# Altium schematic sheet esp32_breakout.SchDoc
size A1
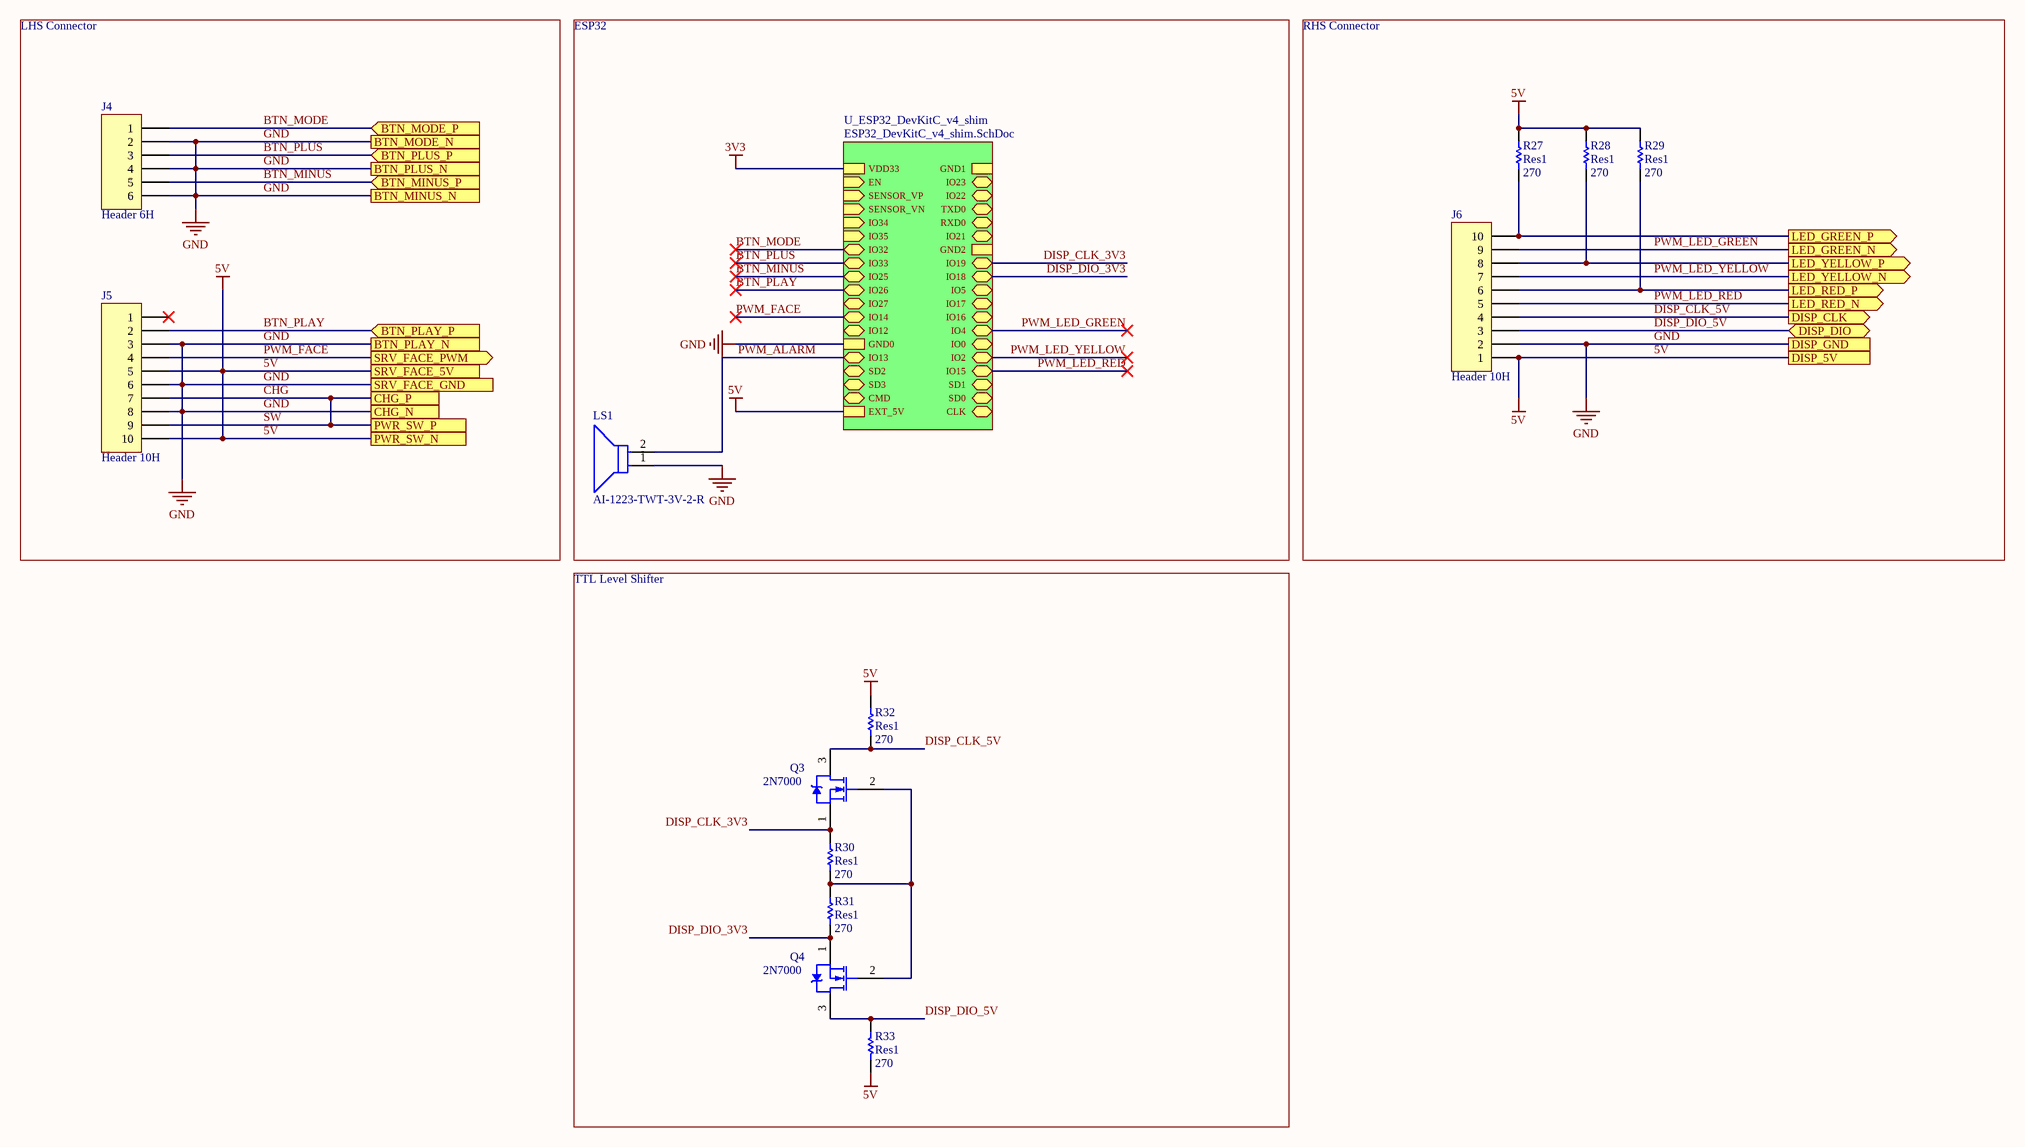
[diagram p0: esp32_breakout.SchDoc]

## Parts
J4  Header 6H  [HDR1X6H]
J5  Header 10H  [HDR1X10H]
J6  Header 10H  [HDR1X10H]
LS1  AI-1223-TWT-3V-2-R  [FP-AI-1223-TWT-3V-2-R-MFG]
Q3  2N7000  [ONSC-TO-92-3-29-11]
Q4  2N7000  [ONSC-TO-92-3-29-11]
R27  Res1  value 270  [AXIAL-0.3]
R28  Res1  value 270  [AXIAL-0.3]
R29  Res1  value 270  [AXIAL-0.3]
R30  Res1  value 270  [AXIAL-0.3]
R31  Res1  value 270  [AXIAL-0.3]
R32  Res1  value 270  [AXIAL-0.3]
R33  Res1  value 270  [AXIAL-0.3]

## Blocks framed on the sheet
LHS Connector: J4 J5
ESP32: LS1
RHS Connector: J6 R27-R29
TTL Level Shifter: Q3 Q4 R30-R33

## Sub-sheets
U_ESP32_DevKitC_v4_shim = ESP32_DevKitC_v4_shim.SchDoc: IO23 (bidir), IO22 (bidir), TXD0 (bidir), RXD0 (bidir), IO21 (bidir), IO19 (bidir), IO18 (bidir), IO5 (bidir), IO17 (bidir), IO16 (bidir), IO4 (bidir), IO0 (bidir), IO2 (bidir), IO15 (bidir), SD1 (bidir), SD0 (bidir), CLK (bidir), GND1, GND2, VDD33, EN (in), SENSOR_VP (in), SENSOR_VN (in), IO34 (in), IO35 (in), IO32 (bidir), IO33 (bidir), IO25 (bidir), IO26 (bidir), IO27 (bidir), IO14 (bidir), IO12 (bidir), GND0, IO13 (bidir), SD2 (bidir), SD3 (bidir), CMD (bidir), EXT_5V

## Ports
BTN_MINUS_N, BTN_MINUS_P (in), BTN_MODE_N, BTN_MODE_P (in), BTN_PLAY_N, BTN_PLAY_P (in), BTN_PLUS_N, BTN_PLUS_P (in), CHG_N, CHG_P, DISP_5V, DISP_CLK (out), DISP_DIO (bidir), DISP_GND, LED_GREEN_N (out), LED_GREEN_P (out), LED_RED_N (out), LED_RED_P (out), LED_YELLOW_N (out), LED_YELLOW_P (out), PWR_SW_N, PWR_SW_P, SRV_FACE_5V, SRV_FACE_GND, SRV_FACE_PWM (out)

## Nets
3V3: sheet U_ESP32_DevKitC_v4_shim/VDD33
5V: J5.5 J5.10 J6.1 R27.2 R28.2 R29.2 R32.2 R33.2 ; port SRV_FACE_5V, port PWR_SW_N, port DISP_5V, sheet U_ESP32_DevKitC_v4_shim/EXT_5V
GND: J4.2 J4.4 J4.6 J5.3 J5.6 J5.8 J6.2 LS1.1(C) ; port BTN_MODE_N, port BTN_PLUS_N, port BTN_MINUS_N, port BTN_PLAY_N, port SRV_FACE_GND, port CHG_N, port DISP_GND, sheet U_ESP32_DevKitC_v4_shim/GND0
BTN_MINUS: J4.5 ; port BTN_MINUS_P, sheet U_ESP32_DevKitC_v4_shim/IO25
BTN_MODE: J4.1 ; port BTN_MODE_P, sheet U_ESP32_DevKitC_v4_shim/IO32
BTN_PLAY: J5.2 ; port BTN_PLAY_P, sheet U_ESP32_DevKitC_v4_shim/IO26
BTN_PLUS: J4.3 ; port BTN_PLUS_P, sheet U_ESP32_DevKitC_v4_shim/IO33
CHG: J5.7 J5.9 ; port CHG_P, port PWR_SW_P  [also labelled SW]
DISP_CLK_3V3: Q3.1(S) R30.2 ; sheet U_ESP32_DevKitC_v4_shim/IO19
DISP_CLK_5V: J6.4 Q3.3(D) R32.1 ; port DISP_CLK
DISP_DIO_3V3: Q4.1(S) R31.1 ; sheet U_ESP32_DevKitC_v4_shim/IO18
DISP_DIO_5V: J6.3 Q4.3(D) R33.1 ; port DISP_DIO
LED_GREEN_P: J6.10 R27.1 ; port LED_GREEN_P
LED_RED_P: J6.6 R29.1 ; port LED_RED_P
LED_YELLOW_P: J6.8 R28.1 ; port LED_YELLOW_P
PWM_ALARM: LS1.2(A) ; sheet U_ESP32_DevKitC_v4_shim/IO13
PWM_FACE: J5.4 ; port SRV_FACE_PWM, sheet U_ESP32_DevKitC_v4_shim/IO14
PWM_LED_GREEN: J6.9 ; port LED_GREEN_N, sheet U_ESP32_DevKitC_v4_shim/IO4
PWM_LED_RED: J6.5 ; port LED_RED_N, sheet U_ESP32_DevKitC_v4_shim/IO15
PWM_LED_YELLOW: J6.7 ; port LED_YELLOW_N, sheet U_ESP32_DevKitC_v4_shim/IO2
NetQ3_2: Q3.2(G) Q4.2(G) R30.1 R31.2

Not connected (* = marked no-connect by the designer): J5 1*

## Library data of the parts
J4 = Header 6H: Header, 6-Pin, Right Angle; LatestRevisionDate: 17-Jul-2002; LatestRevisionNote: Re-released for DXP Platform.; Publisher: Altium Limited
J5 J6 = Header 10H: Header, 10-Pin, Right Angle; LatestRevisionDate: 17-Jul-2002; LatestRevisionNote: Re-released for DXP Platform.; Publisher: Altium Limited
LS1 = CMP-103888-000003-1: BUZZER MAGNETIC 3V 12MM TH; Min Supply Voltage (DC): 2V; Operating Supply Current: 30mA; Max Supply Voltage (DC): 4V; Input Type: DC; Frequency: 2.3kHz; Series: AI; Nominal Supply Voltage (DC): 3V; Packaging: Tray; Max Operating Temperature: 70°C; Height: 7.5mm; Termination: PC Pins; Max Supply Current: 30mA; Mount: Through Hole; Diameter: 12mm; Voltage Rating: 3V; Sensing Method: Magnetic; Min Operating Temperature: -20°C; Contact Plating: Tin
Q3 Q4 = CMP-1058-00936-1: Small Signal MOSFET, 200 mA, 60 V, N-Channel, 3-Pin TO-92, Bulk Box; Manufacturer: On Semiconductor; Ciss Typ (pF): 60; VGS(th) Max (V): 3; Crss Typ (pF): 5; Channel Polarity: N Channel; VGS Max (V): 20; Configuration: Single; PD Max (W): 0.35; Coss Typ (pF): 25; ID Max (A): 0.2; PackageVersion: Rev. AM; ComponentLink3URL: http://www.onsemi.cn/pub_link/Collateral/2N6426-D.PDF; ComponentLink2URL: http://www.onsemi.com/pub_link/Collateral/2N7000-D.PDF; DatasheetVersion: Rev. 8; Mounting Technology: Through Hole; V(BR)DSS Min (V): 60; PartNumber: 2N7000; PackageDescription: 3-Pin Transistor Outline, Body 4.825 x 3.685 mm, Pitch 1.27 mm; ComponentLink2Description: Datasheet; ComponentLink1URL: http://www.onsemi.com/; PackageReference: TO-92-3-29-11_AM_SL; Packing: Bulk Box; ComponentLink1Description: Manufacturer URL; Package Type: TO-92; ComponentLink3Description: Package Specification
R27-R33 = Res1: Resistor; Published: 8-Jun-2000; LatestRevisionDate: 17-Jul-2002; LatestRevisionNote: Re-released for DXP Platform.; PackageReference: AXIAL-0.3; Publisher: Altium Limited; PackageDescription: Axial Device, Thru-Hole; 2 Leads; 0.3 in Pin Spacing